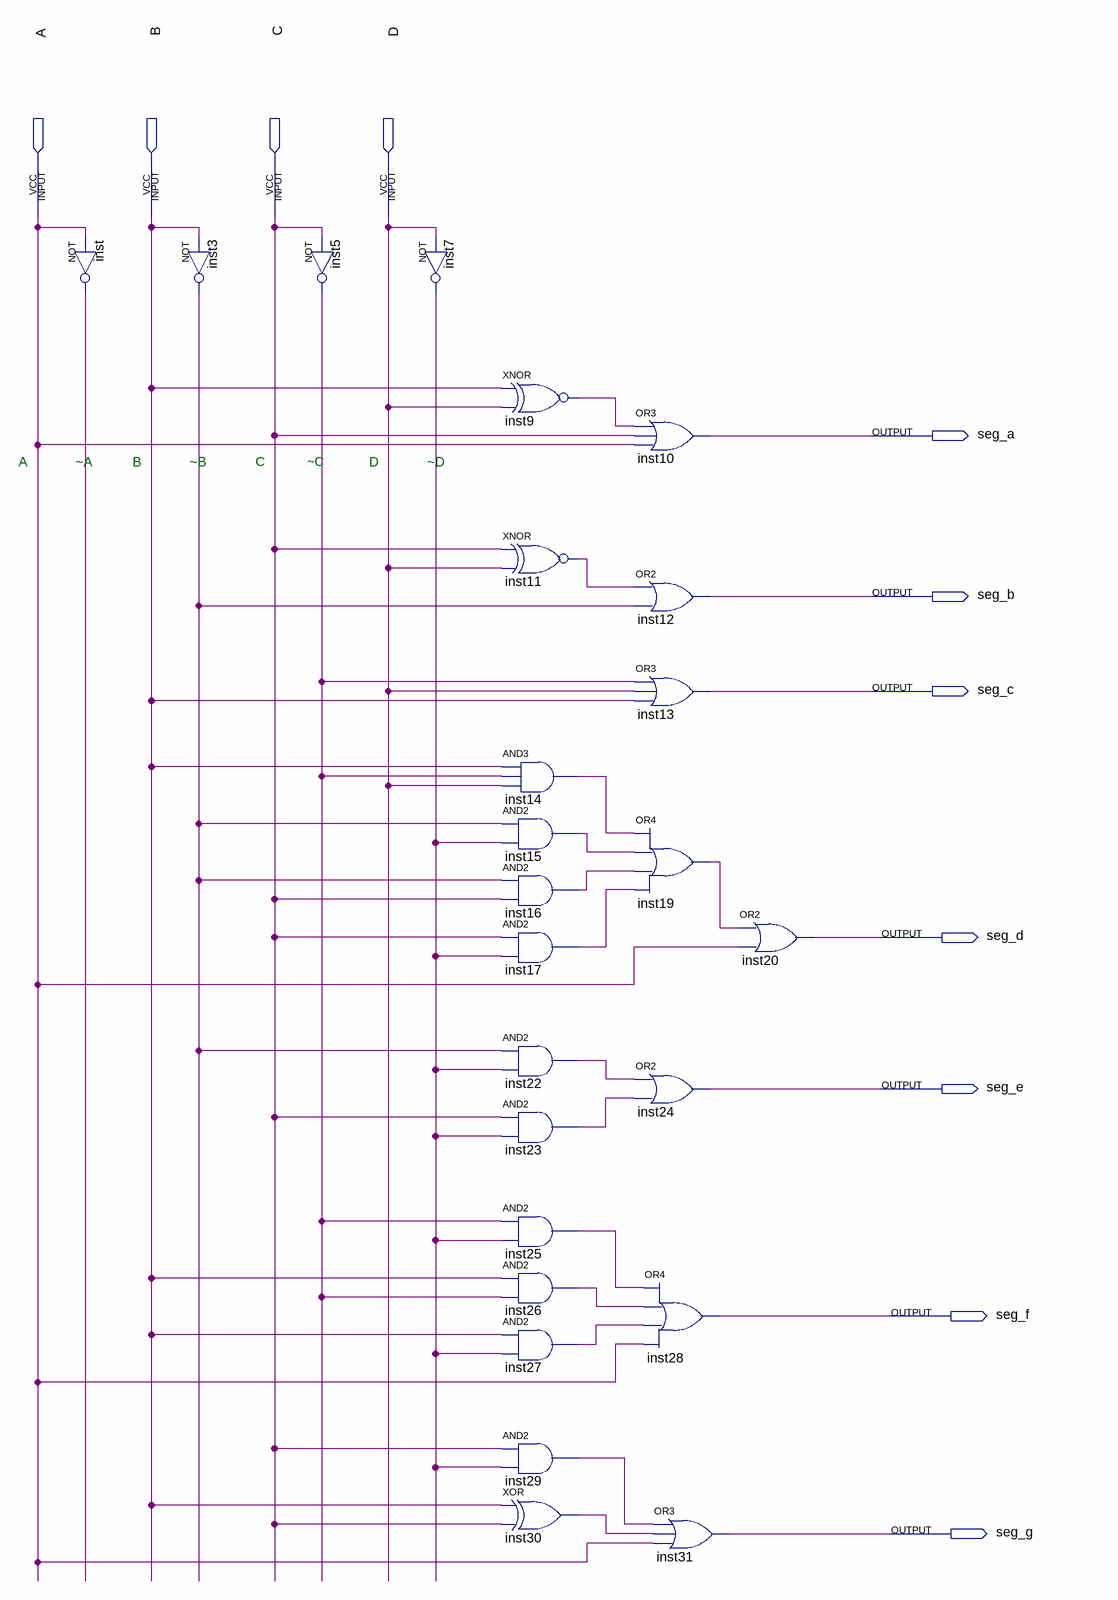
[diagram p0: schematic sheet]
// Quartus schematic decod_display7seg.bdf as structural Verilog: 25 symbols, 11 pins
module decod_display7seg (
  input  A,
  input  B,
  input  C,
  input  D,
  output seg_a,
  output seg_b,
  output seg_c,
  output seg_d,
  output seg_e,
  output seg_f,
  output seg_g
);

  wire inst3_out, inst5_out, inst7_out, inst9_out, inst11_out, inst14_out, inst15_out, inst16_out,
       inst17_out, inst19_out, inst22_out, inst23_out, inst25_out, inst26_out, inst27_out, inst29_out,
       inst30_out, inst_out;

  not inst (inst_out, A);
  not inst3 (inst3_out, B);
  not inst5 (inst5_out, C);
  not inst7 (inst7_out, D);
  xnor inst9 (inst9_out, B, D);
  xnor inst11 (inst11_out, C, D);
  and inst14 (inst14_out, B, inst5_out, D);
  and inst15 (inst15_out, inst3_out, inst7_out);
  and inst16 (inst16_out, inst3_out, C);
  and inst17 (inst17_out, C, inst7_out);
  and inst22 (inst22_out, inst3_out, inst7_out);
  and inst23 (inst23_out, C, inst7_out);
  and inst25 (inst25_out, inst5_out, inst7_out);
  and inst26 (inst26_out, B, inst5_out);
  and inst27 (inst27_out, B, inst7_out);
  and inst29 (inst29_out, C, inst7_out);
  xor inst30 (inst30_out, B, C);
  or inst10 (seg_a, inst9_out, C, A);
  or inst12 (seg_b, inst11_out, inst3_out);
  or inst13 (seg_c, inst5_out, D, B);
  or inst19 (inst19_out, inst14_out, inst15_out, inst16_out, inst17_out);
  or inst24 (seg_e, inst22_out, inst23_out);
  or inst28 (seg_f, inst25_out, inst26_out, inst27_out, A);
  or inst31 (seg_g, inst29_out, inst30_out, A);
  or inst20 (seg_d, inst19_out, A);

  // Notes on the sheet:
  //   A            ~A
  //   B            ~B
  //   C            ~C
  //   D            ~D
endmodule
